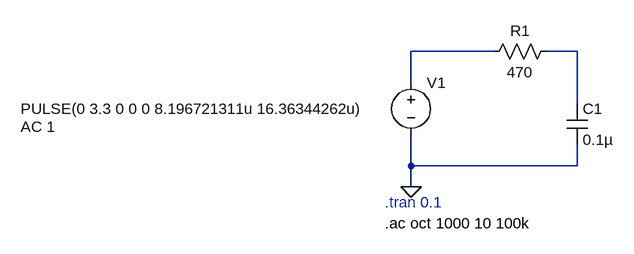
[diagram p0: schematic PWM_filter.asc]
PWM_filter.asc, the LTspice schematic file:
Version 4
SHEET 1 880 680
WIRE 208 64 80 64
WIRE 336 64 288 64
WIRE 80 112 80 64
WIRE 336 144 336 64
WIRE 80 240 80 192
WIRE 336 240 336 208
WIRE 336 240 80 240
WIRE 80 272 80 240
FLAG 80 272 0
SYMBOL res 304 48 R90
WINDOW 0 0 56 VBottom 2
WINDOW 3 32 56 VTop 2
SYMATTR InstName R1
SYMATTR Value 470
SYMBOL cap 320 144 R0
SYMATTR InstName C1
SYMATTR Value 0.1µ
SYMBOL voltage 80 96 R0
WINDOW 3 -601 56 Left 2
WINDOW 123 -601 84 Left 2
WINDOW 39 0 0 Left 0
SYMATTR InstName V1
SYMATTR Value PULSE(0 3.3 0 0 0 8.196721311u 16.36344262u)
SYMATTR Value2 AC 1
TEXT 40 296 Left 2 ;.tran 0.1
TEXT 40 328 Left 2 !.ac oct 1000 10 100k

The netlist it stands for:
* PWM_filter.asc
R1 N002 N001 470
C1 N002 0 0.1µ
V1 N001 0 PULSE(0 3.3 0 0 0 8.196721311u 16.36344262u) AC 1
* .tran 0.1
.ac oct 1000 10 100k
.backanno
.end